# EAGLE design LongTermTempMon_4ch (EAGLE 6.5.0)
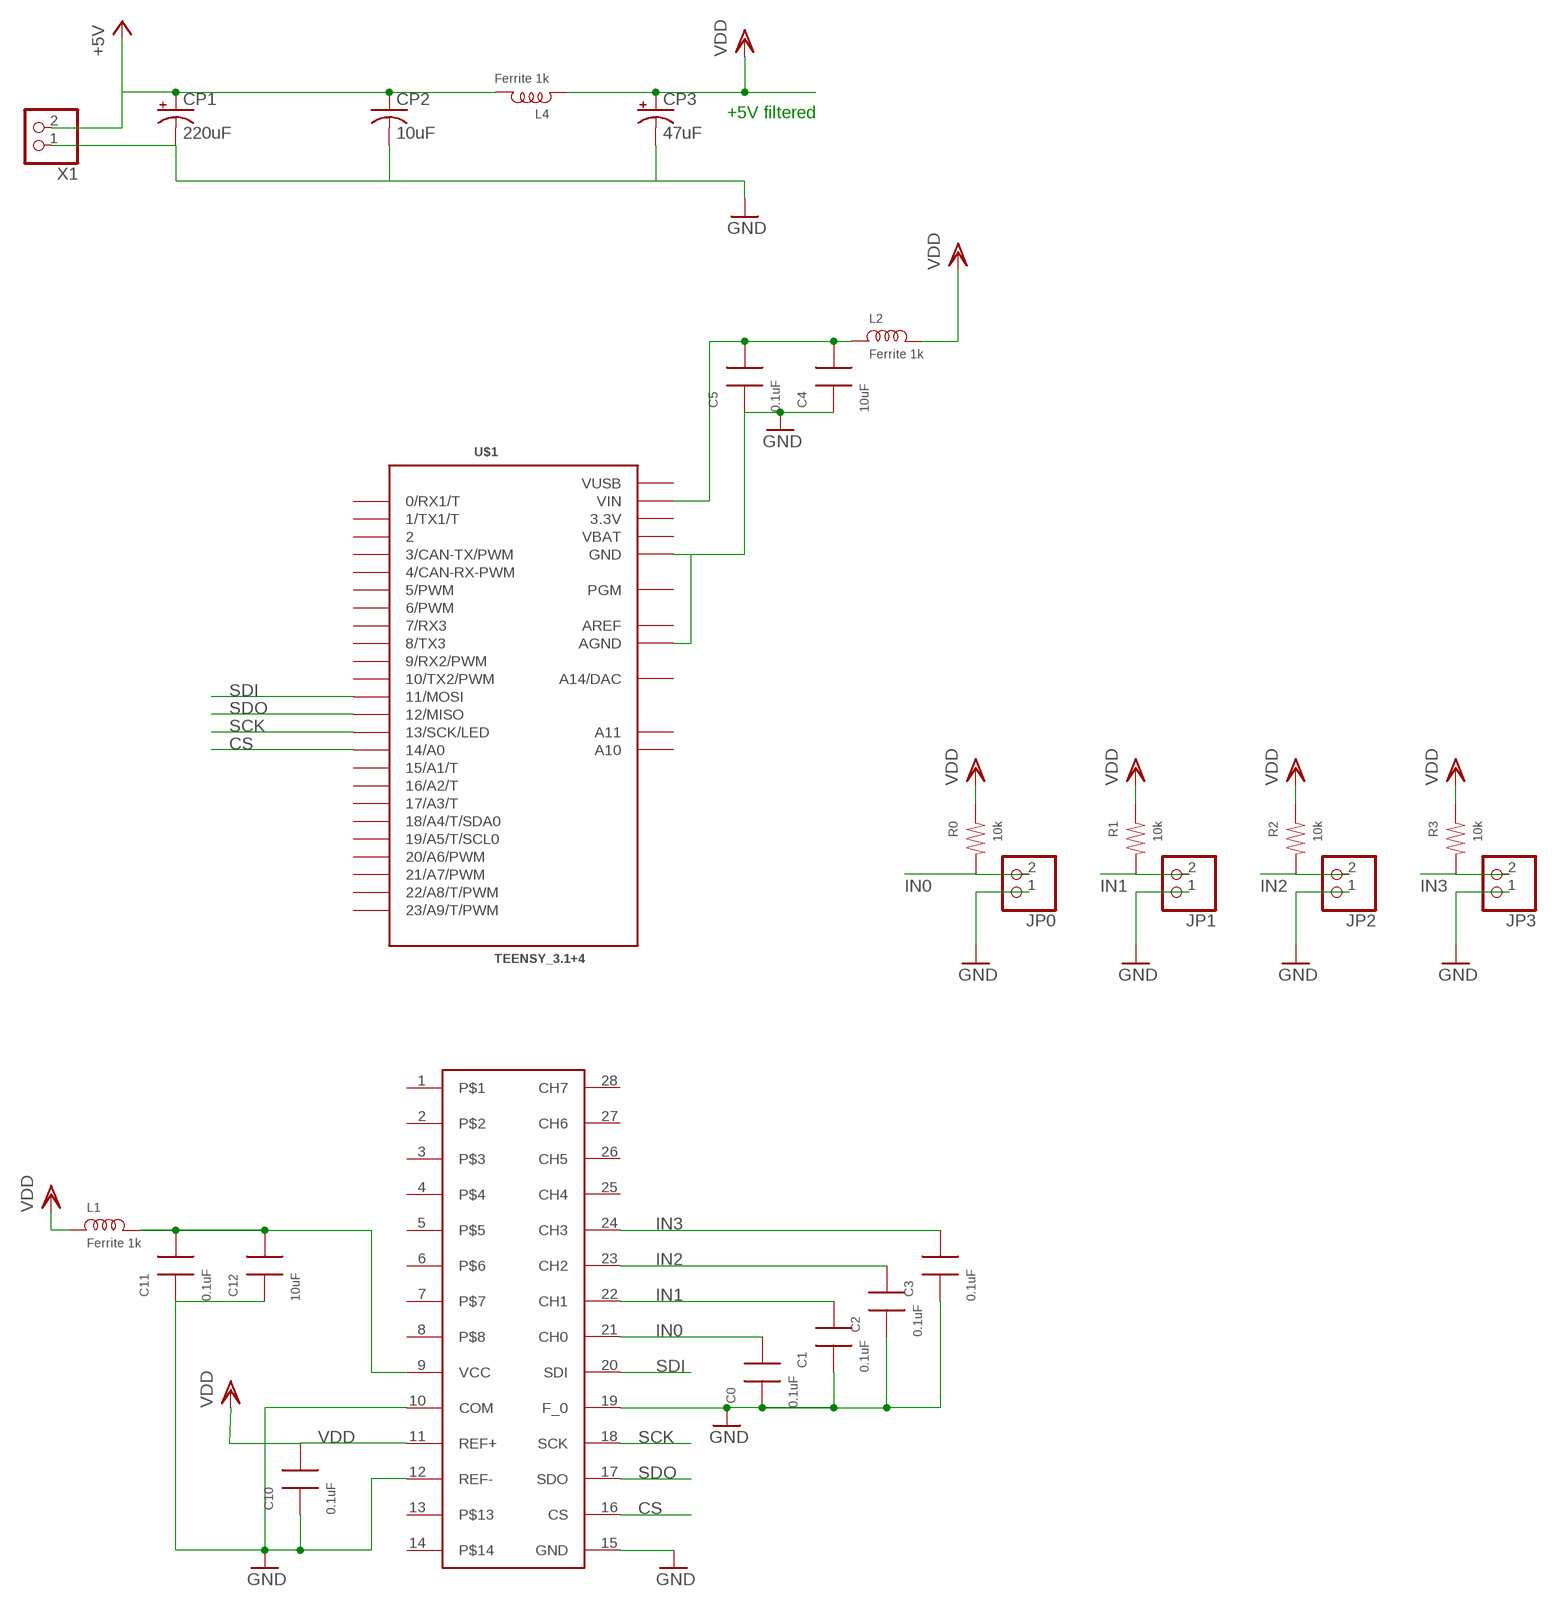
[diagram p0: schematic, sheet 1]

## Parts
C0  0.1uF  CAP0603  [0603]
C1  0.1uF  CAP0603  [0603]
C2  0.1uF  CAP0603  [0603]
C3  0.1uF  CAP0603  [0603]
C4  10uF  CAP0805  [0805]
C5  0.1uF  CAP0603  [0603]
C10  0.1uF  CAP0603  [0603]
C11  0.1uF  CAP0603  [0603]
C12  10uF  CAP0805  [0805]
CP1  220uF  CPOL-USF  [PANASONIC_F]
CP2  10uF  C-USC0805K  [C0805K]
CP3  47uF  CPOL-USCT7343  [CT7343]
IC2  LTC2418  [SSOP28]
JP0  SCRWTRM-1X2  [1X02_SCRWTRM]
JP1  SCRWTRM-1X2  [1X02_SCRWTRM]
JP2  SCRWTRM-1X2  [1X02_SCRWTRM]
JP3  SCRWTRM-1X2  [1X02_SCRWTRM]
L1  Ferrite 1k  INDUCTOR-0805  [0805]
L2  Ferrite 1k  INDUCTOR-0805  [0805]
L4  Ferrite 1k  INDUCTOR-0805  [0805]
R0  10k  RES1206  [1206]
R1  10k  RES1206  [1206]
R2  10k  RES1206  [1206]
R3  10k  RES1206  [1206]
U$1  TEENSY_3.1+4  [TEENSY_3.1+4]
X1  SCRWTRM-1X2  [1X02_SCRWTRM]

## Nets
+5V: CP1.+ CP2.1 L4.2 X1.2
CS: IC2.16(CS) U$1.14/A0
GND: C0.1 C1.1 C2.1 C3.1 C4.1 C5.1 C10.1 C11.1 C12.1 CP1.- CP2.2 CP3.- IC2.10(COM) IC2.12(REF-) IC2.15(GND) IC2.19(F_0) JP0.1 JP1.1 JP2.1 JP3.1 U$1.AGND U$1.GND U$1.GND1(GND) X1.1
IN0: C0.2 IC2.21(CH0) JP0.2 R0.2
IN1: C1.2 IC2.22(CH1) JP1.2 R1.2
IN2: C2.2 IC2.23(CH2) JP2.2 R2.2
IN3: C3.2 IC2.24(CH3) JP3.2 R3.2
N$4: C11.2 C12.2 IC2.9(VCC) L1.2
N$25: C4.2 C5.2 L2.1 U$1.VIN
SCK: IC2.18(SCK) U$1.13(13/SCK/LED)
SDI: IC2.20(SDI) U$1.11(11/MOSI)
SDO: IC2.17(SDO) U$1.12(12/MISO)
VDD: C10.2 CP3.+ IC2.11(REF+) L1.1 L2.2 L4.1 R0.1 R1.1 R2.1 R3.1
Unconnected: IC2.1 IC2.2 IC2.3 IC2.4 IC2.5 IC2.6 IC2.7 IC2.8 IC2.13 IC2.14 IC2.25(CH4) IC2.26(CH5) IC2.27(CH6) IC2.28(CH7) U$1.0(0/RX1/T) U$1.1(1/TX1/T) U$1.2 U$1.3(3/CAN-TX/PWM) U$1.4(4/CAN-RX-PWM) U$1.5(5/PWM) U$1.6(6/PWM) U$1.7(7/RX3) U$1.8(8/TX3) U$1.9(9/RX2/PWM) U$1.10(10/TX2/PWM) U$1.15/A1(15/A1/T) U$1.16/A2(16/A2/T) U$1.17/A3(17/A3/T) U$1.18/A4(18/A4/T/SDA0) U$1.19/A5(19/A5/T/SCL0) U$1.20/A6(20/A6/PWM) U$1.21/A7(21/A7/PWM) U$1.22/A8(22/A8/T/PWM) U$1.23/A9(23/A9/T/PWM) U$1.A10 U$1.A11 U$1.A14(A14/DAC) U$1.PGM

## Notes on the sheet
- +5V filtered

## Power pins joined to a net without a drawn wire
3.3V: U$1.3.3V U$1.3.3V1(3.3V)
AREF: U$1.AREF
VBAT: U$1.VBAT
VUSB: U$1.VUSB

## Library data of the parts
C0 C1-C5 C10-C12 = rlc-jqi:CAP: SMT Capacitor
CP1 CP3 = rcl:CPOL-US: POLARIZED CAPACITOR, American symbol
CP2 = rcl:C-US: CAPACITOR, American symbol
IC2 = Lin-Temp-Controller:LTC2418; DIGIKEY: LTC2418CGN-ND
JP0 JP1-JP3 X1 = Lin-Temp-Controller:SCRWTRM-1X2: Screw Terminal; DIGIKEY: ED2635-ND; MFR_PN: OSTTE020161
L1 L2 L4 = rlc-jqi:INDUCTOR: SMT Inductor.
R0 R1-R3 = rlc-jqi:RES: SMT Resistor
U$1 = mcu-accessories:TEENSY_3.1+4: Footprint for Teensy 3.1 board using all through-holes, i.e. the entire perimeter plus the 4 through-holes inboard (A10,A11,AREF, VUSB)

## Board
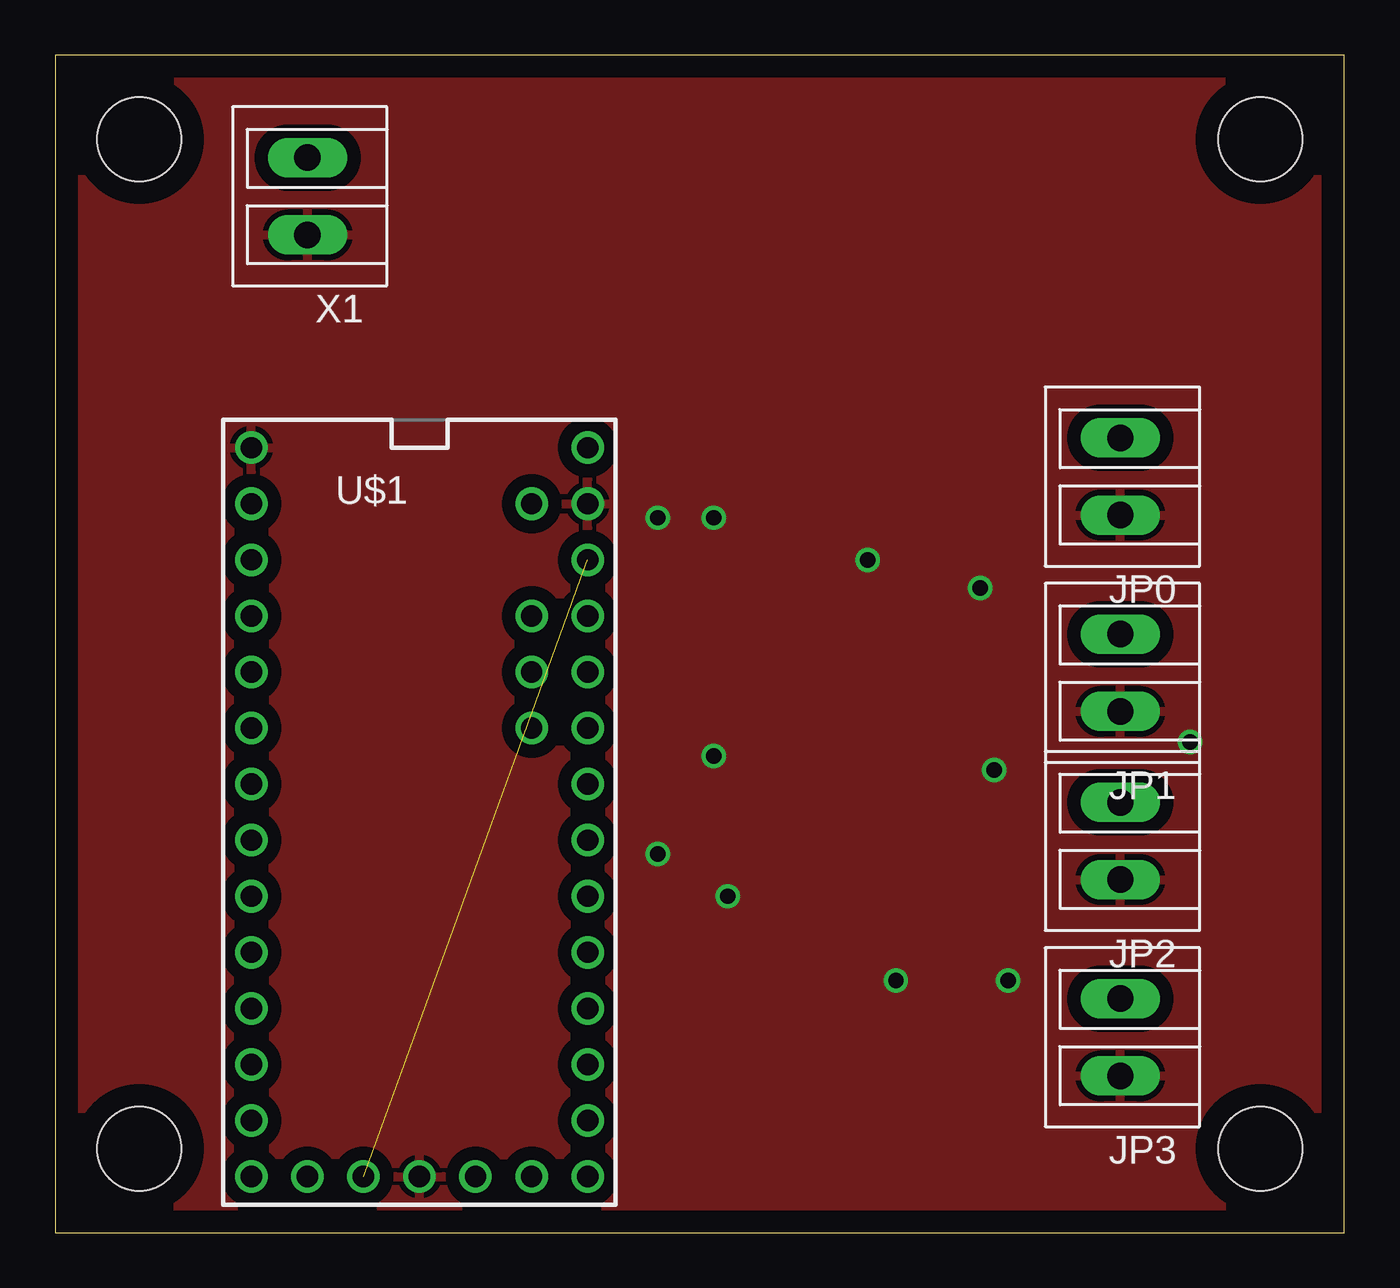
[diagram p1: board, top side]
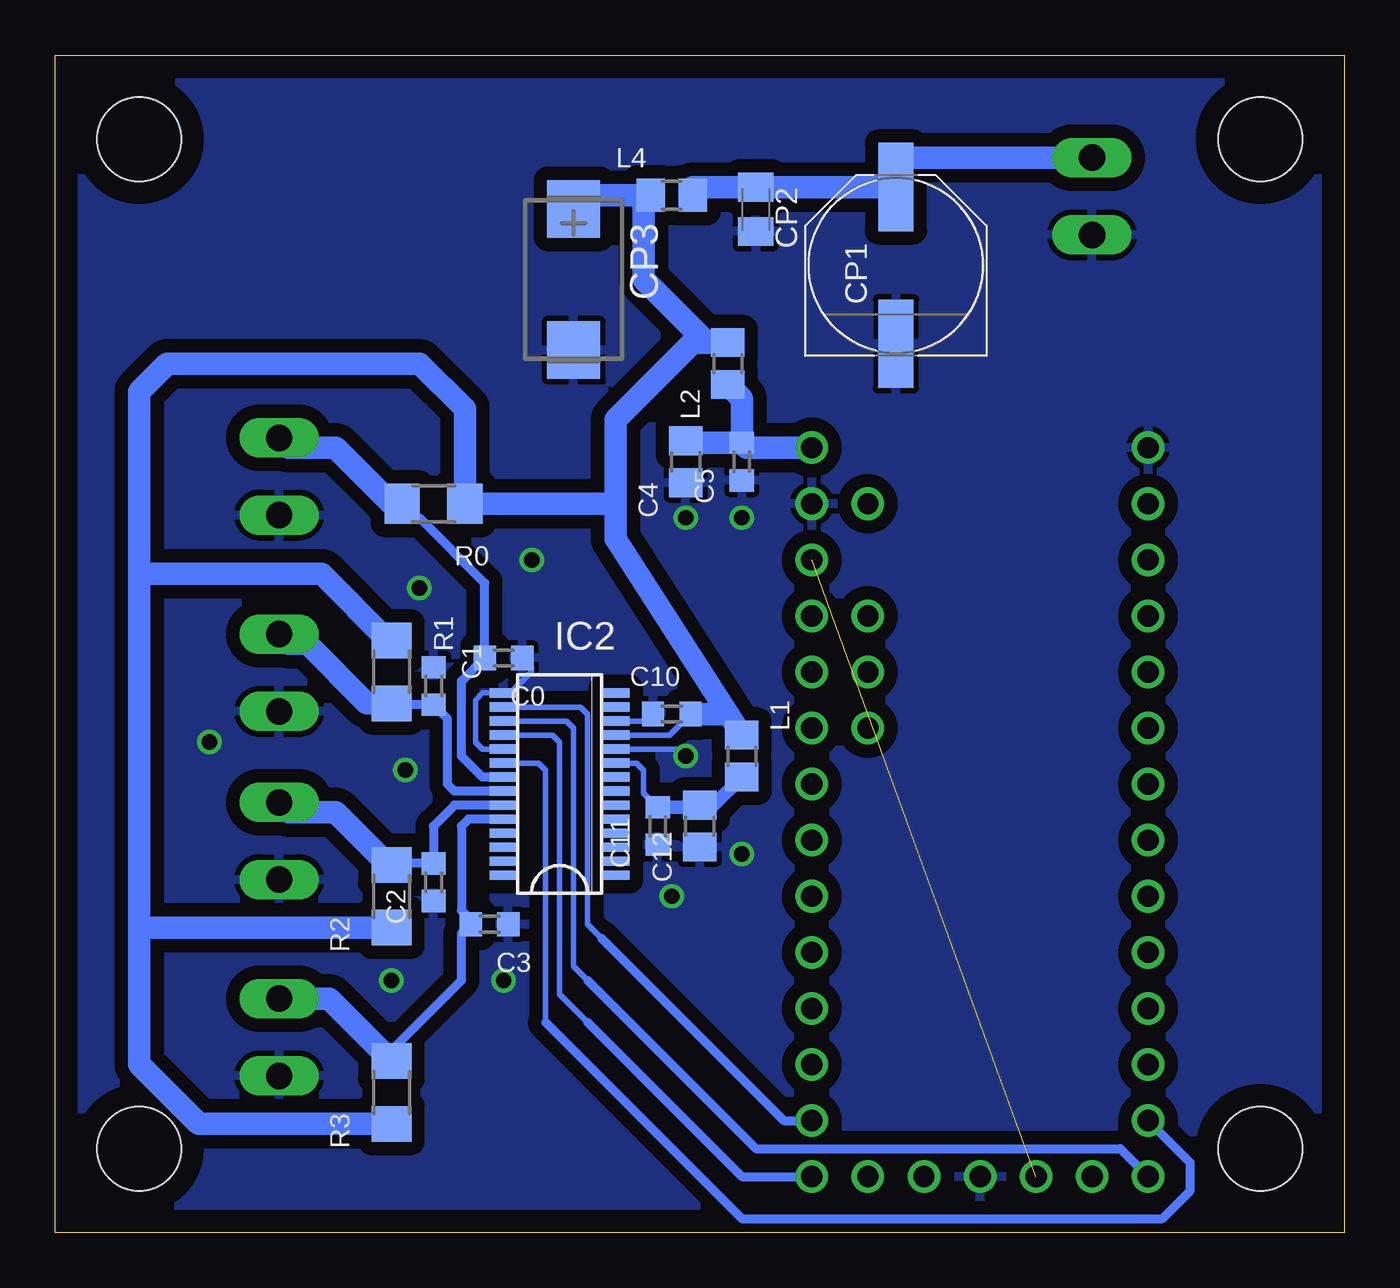
[diagram p2: board, bottom side, seen from below]

Size 58.42 x 53.34 mm. Coordinates in mm from the lower left corner, seen from the top.
Outline: 0,0 58.42,0 58.42,53.34 0,53.34 0,0
Copper layers (1*16): Top 0.035mm / dielectric 1.5mm / Bottom 0.035mm
Design rules "default": minimum track width 10mil, minimum drill 24mil, track to track 8mil, track to pad 8mil, pad to pad 8mil, via to via 8mil, smd to smd 8mil, copper to edge 40mil, drill to drill 8mil, minimum pad ring 10mil, minimum via ring 8mil, stop-mask expansion 4mil, vias tented up to drill 0mil, thermal gap 10mil
Holes 3.8 mm at 3.81,3.81 3.81,49.53 54.61,49.53 54.61,3.81

### Footprints (pad centres in the part's own frame; a part is rotated, then mirrored left to right if it is on the bottom)
0603 = smd 1 x 1.1: 1 -0.85,0; 2 0.85,0
0805 = smd 1.3 x 1.5: 1 -0.95,0; 2 0.95,0
PANASONIC_F = smd 4 x 1.6: + 3.55,0; - -3.55,0
C0805K = smd 1.3 x 1.6: 1 -1,0; 2 1,0
CT7343 = smd 2.6 x 2.4: + -3.2,0; - 3.2,0
SSOP28 = smd 1.27 x 0.419: 1 -2.54,4.128; 2 -2.54,3.493; 3 -2.54,2.857; 4 -2.54,2.223; 5 -2.54,1.587; 6 -2.54,0.953; 7 -2.54,0.318; 8 -2.54,-0.318; 9 -2.54,-0.953; 10 -2.54,-1.587; 11 -2.54,-2.223; 12 -2.54,-2.857; 13 -2.54,-3.493; 14 -2.54,-4.128; 15 2.54,-4.128; 16 2.54,-3.493; 17 2.54,-2.857; 18 2.54,-2.223; 19 2.54,-1.587; 20 2.54,-0.953; 21 2.54,-0.318; 22 2.54,0.318; 23 2.54,0.953; 24 2.54,1.587; 25 2.54,2.223; 26 2.54,2.857; 27 2.54,3.493; 28 2.54,4.128
1X02_SCRWTRM = drill 1.2 long: 1 -1.79,-0.01; 2 1.71,-0.01
1206 = smd 1.6 x 1.803: 1 -1.422,0; 2 1.422,0
TEENSY_3.1+4 = drill 0.965: 0 -7.62,15.24; 1 -7.62,12.7; 2 -7.62,10.16; 3 -7.62,7.62; 3.3V 7.62,12.7; 3.3V1 -2.54,-15.24; 4 -7.62,5.08; 5 -7.62,2.54; 6 -7.62,0; 7 -7.62,-2.54; 8 -7.62,-5.08; 9 -7.62,-7.62; 10 -7.62,-10.16; 11 -7.62,-12.7; 12 -7.62,-15.24; 13 7.62,-15.24; 14/A0 7.62,-12.7; 15/A1 7.62,-10.16; 16/A2 7.62,-7.62; 17/A3 7.62,-5.08; 18/A4 7.62,-2.54; 19/A5 7.62,0; 20/A6 7.62,2.54; 21/A7 7.62,5.08; 22/A8 7.62,7.62; 23/A9 7.62,10.16; A10 5.08,7.62; A11 5.08,5.08; A14 5.08,-15.24; AGND 7.62,15.24; AREF 5.08,10.16; GND -7.62,17.78; GND1 0,-15.24; PGM 2.54,-15.24; VBAT -5.08,-15.24; VIN 7.62,17.78; VUSB 5.08,15.24

### Placement (x,y rotation side)
C0  38.1,26.04 180 bottom
C1  41.27,24.77 270 bottom
C2  41.27,15.88 90 bottom
C3  38.73,13.97 180 bottom
C4  29.84,34.92 90 bottom
C5  27.3,34.92 90 bottom
C10  30.48,23.5 0 bottom
C11  31.11,18.41 90 bottom
C12  29.21,18.41 90 bottom
CP1  20.32,43.81 90 bottom
CP2  26.67,46.35 270 bottom
CP3  34.92,43.18 270 bottom
IC2  35.56,20.32 180 bottom
JP0  48.26,34.29 90 top
JP1  48.26,25.4 90 top
JP2  48.26,17.78 90 top
JP3  48.26,8.89 90 top
L1  27.3,21.59 270 bottom
L2  27.94,39.37 90 bottom
L4  30.48,46.99 0 bottom
R0  41.27,33.02 180 bottom
R1  43.18,25.4 270 bottom
R2  43.18,15.24 90 bottom
R3  43.18,6.35 90 bottom
U$1  16.51,17.78 0 top
X1  11.43,46.99 90 top

### Tracks (layer width: path | path; a pad name or v marks a point on that pad's centre or on a via)
3.3V  (1 unrouted)
+5V
  Bottom 1.016: X1.2 20.32,48.7 CP1.+ 26.67,47.37 CP2.1 29.53,47.35 L4.2
CS
  Bottom 0.254: IC2.16 34.61,23.81 34.29,23.5 34.29,13.97 33.66,13.34
  Bottom 0.406: U$1.14/A0 25.4,5.08 33.66,13.34
GND  (via drill 0.7)
  Bottom 0.254: IC2.12 31.65,23.18 C10.1 | IC2.19 39.05,21.91 39.37,22.23 39.37,24.13 39.05,24.45 IC2.15 37.78,24.45 36.83,25.4 36.83,25.61 C0.1 | IC2.10 30.16,21.91 v29.84,21.59
  other vias: 43.18,11.43 41.91,29.21 36.83,30.48 38.1,11.43 30.48,15.24 27.3,17.14 27.3,32.38 29.84,32.38 42.55,20.95 51.44,22.23
  pour Bottom (isolate 0.61): -2.54,54.61 -2.54,-2.54 60.96,-2.54 60.96,54.61
  pour Top (isolate 0.61): -1.27,54.61 -1.27,-2.54 62.23,-2.54 62.23,54.61
IN0
  Bottom 0.406: IC2.21 39.05,20.64 40.01,21.59 40.01,24.98 C0.2 38.95,29.43 41.91,32.38 43.03,32.38 R0.2
  Bottom 1.016: R0.2 43.18,33.02 45.72,35.56 47.83,35.56 JP0.2
IN1
  Bottom 0.406: IC2.22 40.32,20 40.64,20.32 40.64,23.28 C1.2 42.81,23.91 R1.2
  Bottom 1.016: R1.2 44.3,23.98 46.99,26.67 47.83,26.67 JP1.2
IN2
  Bottom 0.406: IC2.23 40.32,19.37 41.27,18.41 C2.2 43.12,16.73 R2.2
  Bottom 1.016: R2.2 43.33,16.66 45.72,19.05 47.83,19.05 JP2.2
IN3
  Bottom 0.406: IC2.24 39.69,18.73 40.01,18.41 40.01,14.61 39.59,14.19 C3.2 40.01,13.55 40.01,11.43 43.18,8.26 R3.2
  Bottom 1.016: JP3.2 46.01,10.6 R3.2
N$4
  Bottom 0.254: IC2.9 32.07,21.27 31.75,20.95 31.75,19.9 C11.2
  Bottom 0.61: C11.2 29.31,19.27 C12.2 28.58,19.36 L1.2
N$25
  Bottom 1.016: U$1.VIN 27.09,35.56 C5.2 | C5.2 29.75,35.77 C4.2 | C5.2 27.3,37.78 L2.1
SCK
  Bottom 0.254: IC2.18 35.88,22.54 35.56,22.23 35.56,10.79 34.29,9.53
  Bottom 0.406: 34.29,9.53 27.3,2.54 U$1.13
SDI
  Bottom 0.254: IC2.20 36.51,21.27 36.2,20.95 36.2,9.53
  Bottom 0.406: U$1.11 6.99,3.17 6.99,1.91 8.26,0.64 27.3,0.64 36.2,9.53
SDO
  Bottom 0.254: IC2.17 35.24,23.18 34.92,22.86 34.92,12.06 34.29,11.43
  Bottom 0.406: 34.29,11.43 26.67,3.81 10.16,3.81 U$1.12
VDD
  Bottom 0.254: IC2.11 30.58,22.54 C10.2 | 28.01,23.63 28.15,23.5 27.3,22.65 L1.1
  Bottom 1.016: CP3.+ 34.92,45.72 35.56,45.72 35.56,46.99 L4.1 31.75,46.67 31.75,43.18 28.89,40.32 L2.2 29.53,40.32 33.02,36.83 33.02,33.02 | 33.02,33.02 33.02,31.43 L1.1 | C10.2 28.15,23.5 | 33.02,33.02 R0.1 39.85,37.31 41.91,39.37 53.34,39.37 54.61,38.1 54.61,29.84 | R3.1 51.92,4.93 54.61,7.62 54.61,13.97 | 54.61,13.97 54.61,29.84 | R2.1 54.46,13.82 54.61,13.97 | R1.1 43.33,26.82 46.35,29.84 54.61,29.84